# EAGLE design untitled (EAGLE 9.6.2)
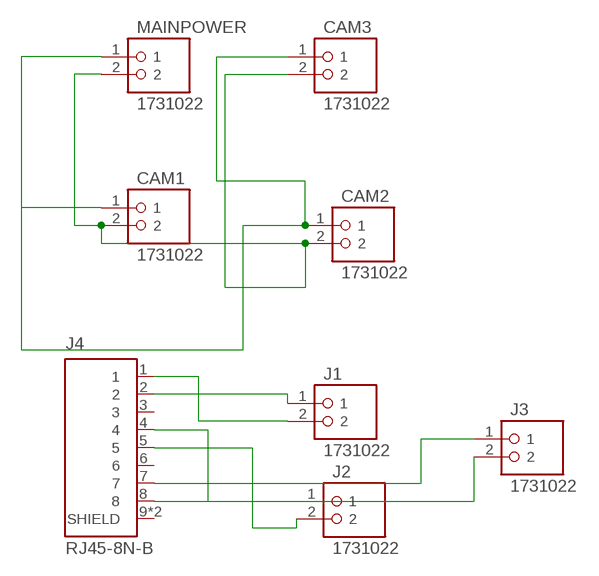
[diagram p0: schematic, sheet 1]

## Parts
CAM1  1731022  [PHOENIX_1731022]
CAM2  1731022  [PHOENIX_1731022]
CAM3  1731022  [PHOENIX_1731022]
J1  1731022  [PHOENIX_1731022]
J2  1731022  [PHOENIX_1731022]
J3  1731022  [PHOENIX_1731022]
J4  RJ45-8N-B  [TE_RJ45-8N-B]
MAINPOWER  1731022  [PHOENIX_1731022]

## Nets
12V: CAM1.1 CAM2.1 CAM3.1 MAINPOWER.1
GND: CAM1.2 CAM2.2 CAM3.2 MAINPOWER.2
N$3: J1.1 J4.2
N$4: J1.2 J4.1
N$5: J2.1 J4.4
N$6: J2.2 J4.5
N$7: J3.1 J4.7
N$8: J3.2 J4.8
Unconnected: J4.3 J4.6 J4.9(SHIELD) J4.10(SHIELD)

## Library data of the parts
CAM1-CAM3 J1-J3 MAINPOWER = terminal block 7.5mm:1731022: Check availability <https://pricing.snapeda.com/parts/1731022/Phoenix%20Contact/view-part?ref=eda>; AVAILABILITY: In Stock; CHECK_PRICES: https://www.snapeda.com/parts/1731022/Phoenix+Contact/view-part/?ref=eda; DESCRIPTION: PCB Terminal Screw 7.5mm 12AWG 630V 24A 2 Position Combicon Control Series | Phoenix Contact 1731022; MF: Phoenix Contact; MP: 1731022; PACKAGE: None; PRICE: None; SNAPEDA_LINK: https://www.snapeda.com/parts/1731022/Phoenix+Contact/view-part/?ref=snap
J4 = ethernet socket:RJ45-8N-B: Check availability <https://pricing.snapeda.com/parts/RJ45-8N-B/TE%20Connectivity/view-part?ref=eda>; AVAILABILITY: In Stock; CHECK_PRICES: https://www.snapeda.com/parts/RJ45-8N-B/TE+Connectivity+Corcom+Filters/view-part/?ref=eda; DESCRIPTION: Corcom FILTER SIGNAL LINE MODULAR 8CONTACTS 1 PORT THROUGH HOLE | TE Connectivity RJ45-8N-B; MF: TE Connectivity; MP: RJ45-8N-B; PACKAGE: None; PRICE: None; SNAPEDA_LINK: https://www.snapeda.com/parts/RJ45-8N-B/TE+Connectivity+Corcom+Filters/view-part/?ref=snap

## Board
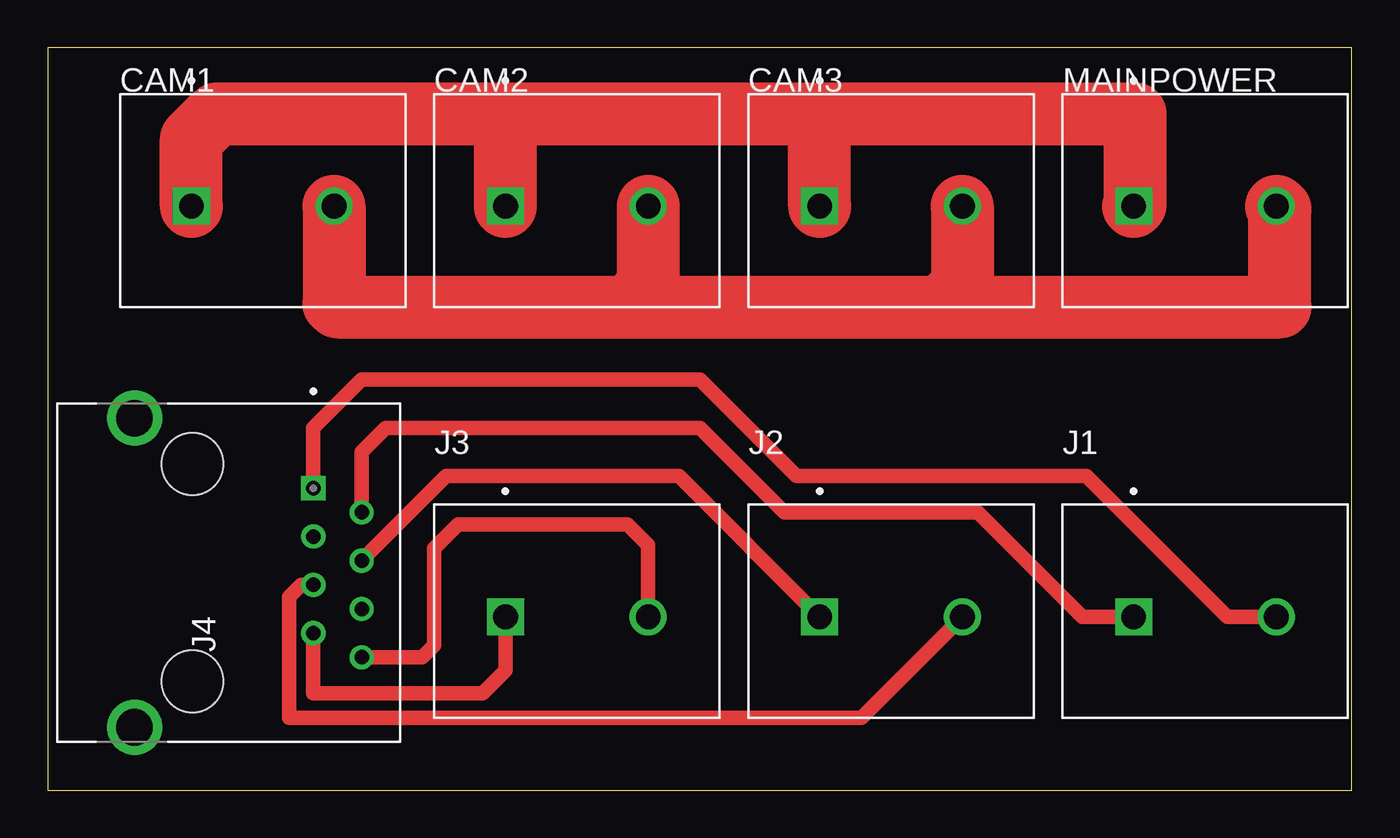
[diagram p1: board, top side]

Size 68.56 x 39.04 mm. Coordinates in mm from the lower left corner, seen from the top.
Outline: 0,0 68.56,0 68.56,39.04 0,39.04 0,0
Copper layers (1*16): Top 0.035mm / dielectric 1.5mm / Bottom 0.035mm
Design rules "default": minimum track width 6mil, minimum drill 0.35mm, track to track 6mil, track to pad 6mil, pad to pad 6mil, via to via 6mil, smd to smd 6mil, copper to edge 40mil, drill to drill 6mil, minimum pad ring 10mil, minimum via ring 8mil, stop-mask expansion 4mil, vias tented up to drill 0mil, thermal gap 10mil

### Footprints (pad centres in the part's own frame; a part is rotated, then mirrored left to right if it is on the bottom)
PHOENIX_1731022 = drill 1.3 square: 1 3.75,5.3 | drill 1.3: 2 11.25,5.3
TE_RJ45-8N-B = drill 0.76 square: 1 -4.445,6.35 | drill 0.76: 2 -3.175,8.89; 3 -1.905,6.35; 4 -0.635,8.89; 5 0.635,6.35; 6 1.905,8.89; 7 3.175,6.35; 8 4.445,8.89 | drill 1.93: 9 -8.125,-3.05; 10 8.125,-3.05 | hole 3.25: -5.715,0; 5.715,0

### Placement (x,y rotation side)
CAM1  3.81,25.4 0 top
CAM2  20.32,25.4 0 top
CAM3  36.83,25.4 0 top
J1  53.34,3.81 0 top
J2  36.83,3.81 0 top
J3  20.32,3.81 0 top
J4  7.62,11.43 270 top
MAINPOWER  53.34,25.4 0 top

### Tracks (layer width: path | path; a pad name or v marks a point on that pad's centre or on a via)
12V
  Top 3.302: CAM1.1 7.56,34.23 8.89,35.56 24.13,35.56 | 24.13,35.56 40.64,35.56 | 40.64,35.56 57.15,35.56 57.15,30.76 MAINPOWER.1 | CAM2.1 24.07,35.5 24.13,35.56 | CAM3.1 40.58,35.5 40.64,35.56
GND
  Top 3.302: CAM1.2 15.06,25.58 15.24,25.4 30.48,25.4 | 30.48,25.4 46.99,25.4 | 46.99,25.4 64.77,25.4 64.77,30.52 MAINPOWER.2 | CAM2.2 31.57,26.49 30.48,25.4 | CAM3.2 48.08,26.49 46.99,25.4
N$3
  Top 0.762: J4.2 16.51,17.78 17.78,19.05 34.29,19.05 38.74,14.6 48.9,14.6 54.39,9.11 J1.1
N$4
  Top 0.762: J1.2 62.01,9.11 54.61,16.51 39.37,16.51 34.29,21.59 16.51,21.59 13.97,19.05 J4.1
N$5
  Top 0.762: J4.4 20.95,16.51 33.18,16.51 J2.1
N$6
  Top 0.762: J4.5 13.33,10.79 12.7,10.16 12.7,3.81 42.78,3.81 J2.2
N$7
  Top 0.762: J3.1 24.07,6.29 22.86,5.08 13.97,5.08 J4.7
N$8
  Top 0.762: J3.2 31.57,12.88 30.48,13.97 21.59,13.97 20.32,12.7 20.32,7.62 19.68,6.98 J4.8